# EAGLE design ATTINY85ZIF (EAGLE 6.5.0)
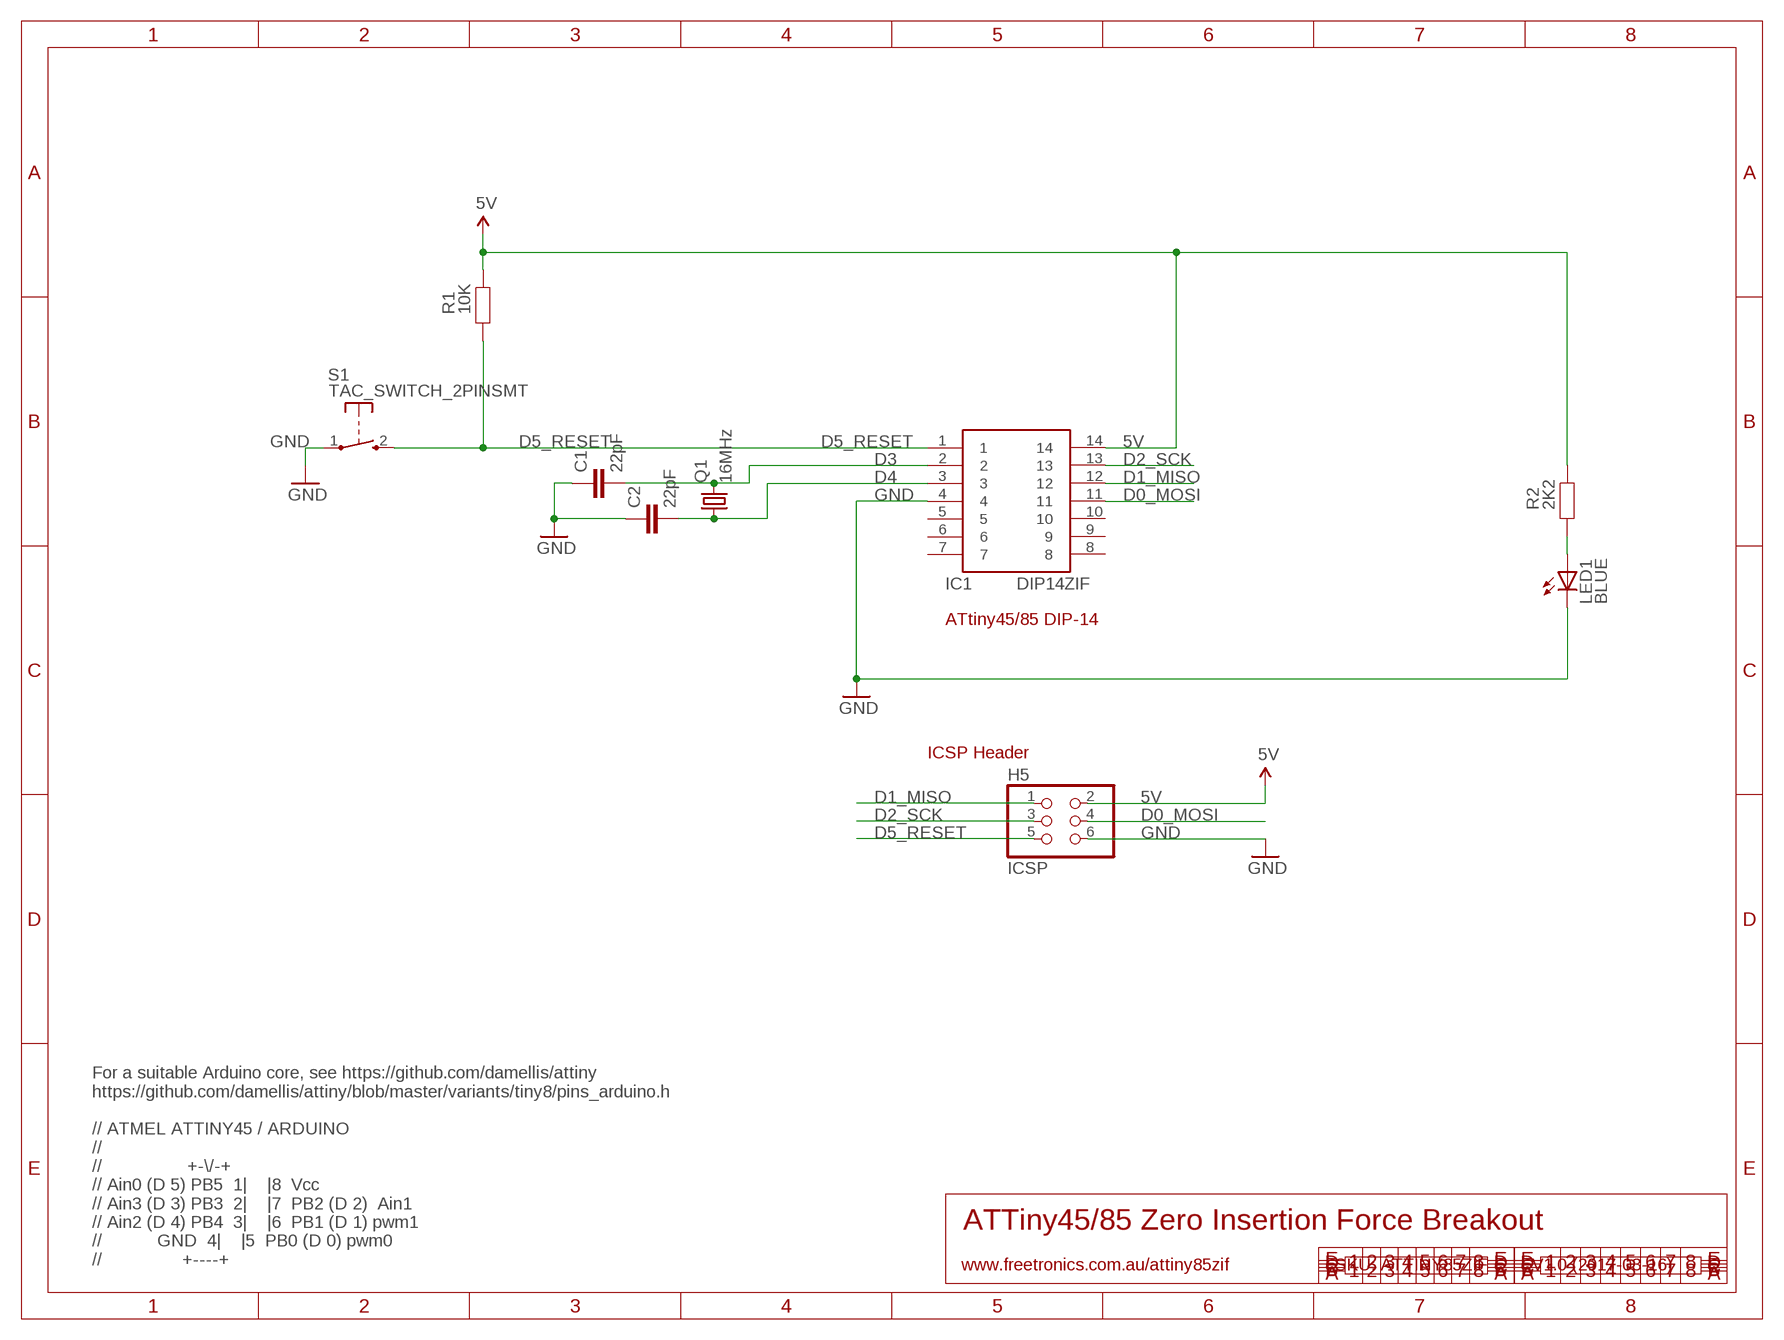
[diagram p0: schematic, sheet 1]

## Parts
C1  22pF  CAP0603  [0603]
C2  22pF  CAP0603  [0603]
H5  ICSP  PINHD-2X3  [2X03]
IC1  DIP14ZIF  [DIL14-3-ZIF]
LED1  BLUE  LED0603  [LED-0603]
Q1  16MHz  CRYSTALHC49US  [HC49US]
R1  10K  RESISTOR0603  [0603]
R2  2K2  RESISTOR0603  [0603]
S1  TAC_SWITCH_2PINSMT  [TACTILE_SWITCH_SMD_2PIN_TINY]

## Nets
5V: H5.2 IC1.14 R1.2 R2.2
D0_MOSI: H5.4 IC1.11
D1_MISO: H5.1 IC1.12
D2_SCK: H5.3 IC1.13
D3: C1.2 IC1.2 Q1.2
D4: C2.2 IC1.3 Q1.1
D5_RESET: H5.5 IC1.1 R1.1 S1.2(S)
GND: C1.1 C2.1 H5.6 IC1.4 LED1.C S1.1(P)
N$3: LED1.A R2.1
Unconnected: IC1.5 IC1.6 IC1.7 IC1.8 IC1.9 IC1.10

## Notes on the sheet
- ATtiny45/85 DIP-14
- ICSP Header
- ATTiny45/85 Zero Insertion Force Breakout
- For a suitable Arduino core, see https://github.com/damellis/attiny
  https://github.com/damellis/attiny/blob/master/variants/tiny8/pins_arduino.h
  
  // ATMEL ATTINY45 / ARDUINO
  //
  //                 +-\/-+
  // Ain0 (D 5) PB5  1|    |8  Vcc
  // Ain3 (D 3) PB3  2|    |7  PB2 (D 2)  Ain1
  // Ain2 (D 4) PB4  3|    |6  PB1 (D 1) pwm1
  //           GND  4|    |5  PB0 (D 0) pwm0
  //                +----+
- www.freetronics.com.au/attiny85zif | SKU: ATTINY85ZIF | V1.0 (2017-03-16)

## Library data of the parts
C1 C2 = freetronics-jon:CAP: Capacitor Standard 0603 ceramic capacitor, and 0.1" leaded capacitor.
H5 = pinhead:PINHD-2X3: PIN HEADER
IC1 = freetronics-jon:DIP14
LED1 = freetronics-jon:LED: LEDs Standard schematic elements and footprints for 5mm, 3mm, 1206, and 0603 sized LEDs. 5mm - Spark Fun Electronics SKU : COM-00529 (and others)
Q1 = freetronics-jon:CRYSTAL: Crystals Various standard crystals. Proven footprints. Spark Fun Electronics SKU : COM-00534
R1 R2 = freetronics-jon:RESISTOR: Resistor Basic schematic elements and footprints for 0603, 1206, and PTH 1/10th watt (small) resistors.
S1 = freetronics-jon:TAC_SWITCH_2PIN: Momentary Tactile Switch - 2 pin

## Board
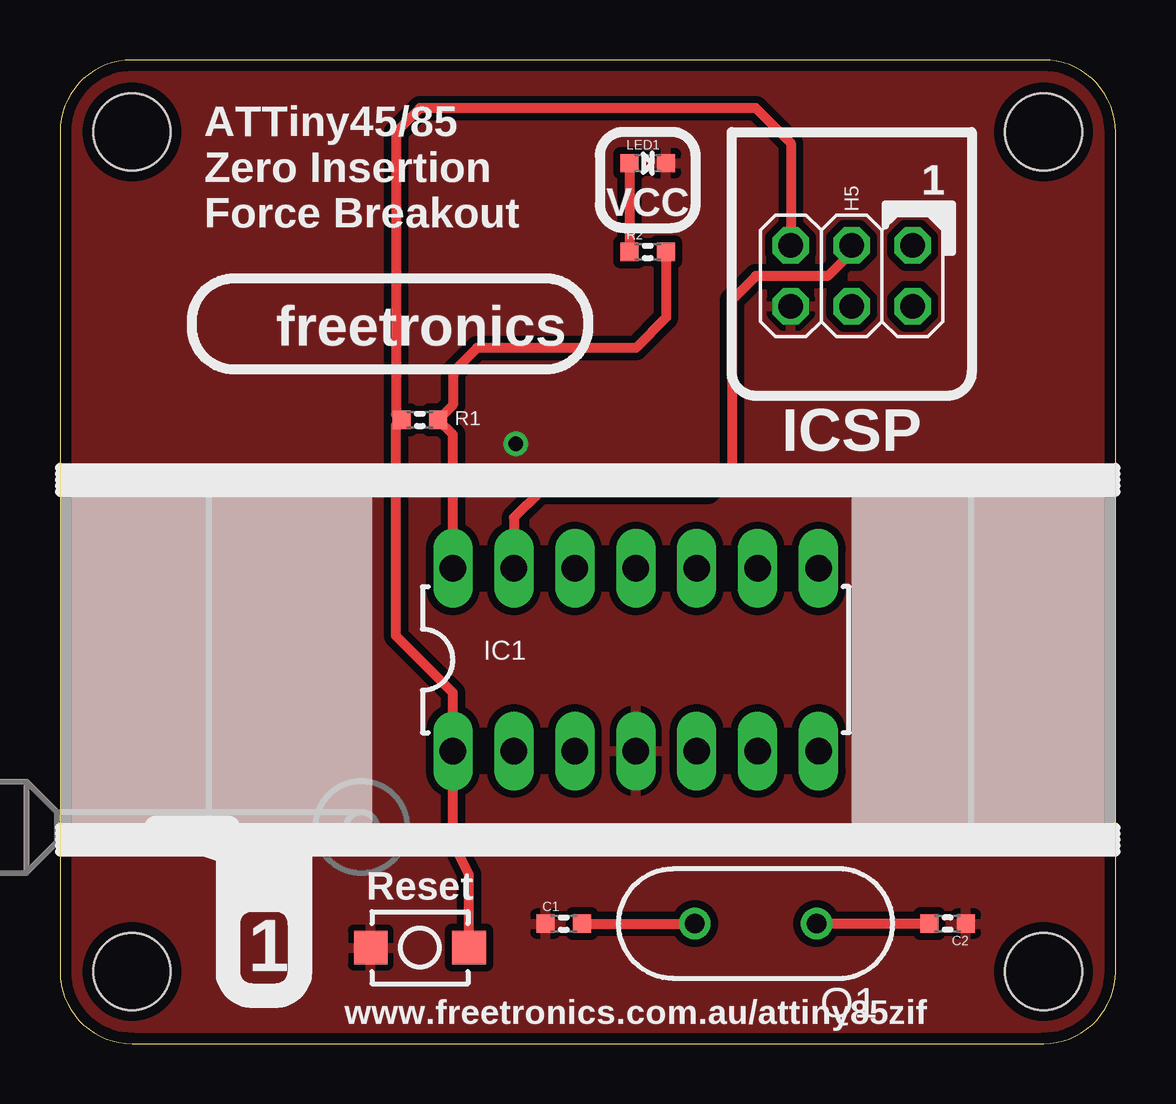
[diagram p1: board, top side]
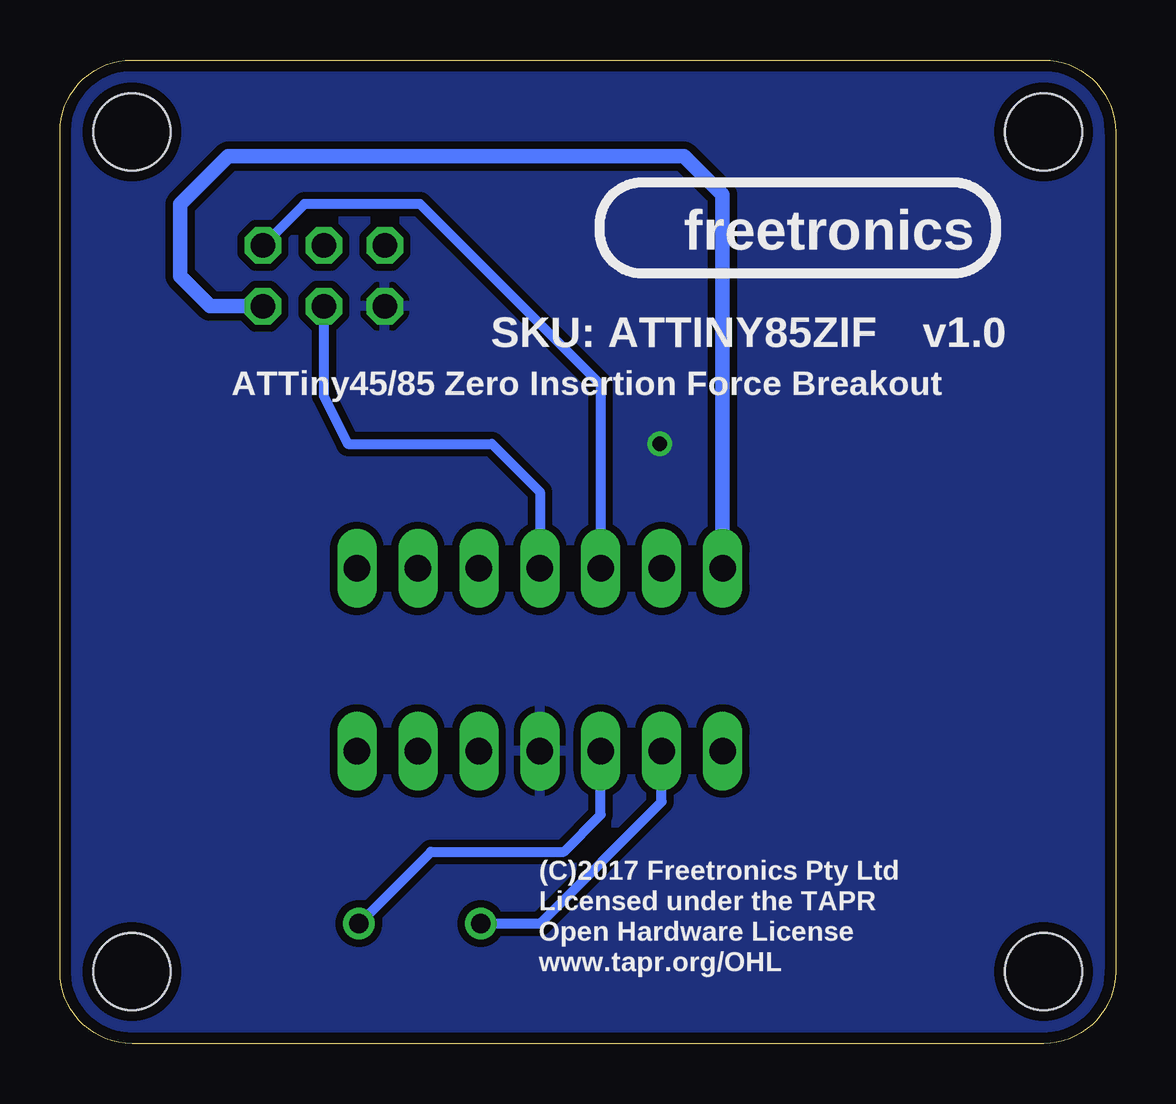
[diagram p2: board, bottom side, seen from below]

Size 44 x 41 mm. Coordinates in mm from the lower left corner, seen from the top.
Outline: 0,3 arc90 3,0 41,0 arc90 44,3 44,38 arc90 41,41 3,41 arc90 0,38 0,3
Copper layers (1*16): Top 0.035mm / dielectric 1.5mm / Bottom 0.035mm
Design rules "default *": minimum track width 10mil, minimum drill 18mil, track to track 10mil, track to pad 10mil, pad to pad 10mil, via to via 10mil, smd to smd 8mil, copper to edge 18mil, drill to drill 8mil, minimum pad ring 10mil, minimum via ring 8mil, stop-mask expansion 4mil, vias tented up to drill 25mil, thermal gap 10mil
Holes 3.2 mm at 41,38 41,3 3,38 3,3

### Footprints (pad centres in the part's own frame; a part is rotated, then mirrored left to right if it is on the bottom)
0603 = smd 0.762 x 0.762: 1 -0.762,0; 2 0.762,0
2X03 = drill 1.016 octagon: 1 -2.54,-1.27; 2 -2.54,1.27; 3 0,-1.27; 4 0,1.27; 5 2.54,-1.27; 6 2.54,1.27
DIL14-3-ZIF = drill 1.1 long: 1 -7.62,-3.81; 2 -5.08,-3.81; 3 -2.54,-3.81; 4 0,-3.81; 5 2.54,-3.81; 6 5.08,-3.81; 7 7.62,-3.81; 8 7.62,3.81; 9 5.08,3.81; 10 2.54,3.81; 11 0,3.81; 12 -2.54,3.81; 13 -5.08,3.81; 14 -7.62,3.81
LED-0603 = smd 0.762 x 0.762: A -0.762,0; C 0.762,0
HC49US = drill 0.813: 1 -2.54,0; 2 2.54,0
TACTILE_SWITCH_SMD_2PIN_TINY = smd 1.4 x 1.4: 1 -2.05,0; 2 2.05,0

### Placement (x,y rotation side)
C1  21,5 0 top
C2  37,5 180 top
H5  33,32 180 top
IC1  24,16 0 top
LED1  24.5,36.7 0 top
Q1  29,5 180 top
R1  15,26 0 top
R2  24.5,33 0 top
S1  15,4 0 top

### Tracks (layer width: path | path; a pad name or v marks a point on that pad's centre or on a via)
5V
  Top 0.406: IC1.14 16.38,25.38 R1.2 16.38,26.62 16.38,28 17.38,29 24,29 25.26,30.26 R2.2
  Bottom 0.61: H5.2 37.73,30.73 39,32 39,35 37,37 18,37 16.38,35.38 IC1.14
D0_MOSI
  Bottom 0.406: H5.4 33,27 32,25 26,25 24,23 IC1.11
D1_MISO
  Bottom 0.406: H5.1 33.81,35 29,35 21.46,27.46 IC1.12
D2_SCK
  Top 0.305: H5.3 33,33
  Top 0.406: 33,33 32,32 29,32 28,31 28,24 27,23 20,23 18.92,21.92 IC1.13
D3
  Top 0.406: C1.2 Q1.2
  Bottom 0.406: Q1.2 24,5 18.92,10.08 IC1.2
D4
  Top 0.406: C2.2 Q1.1
  Bottom 0.406: Q1.1 28.54,8 23,8 21.46,9.54 IC1.3
D5_RESET
  Top 0.406: S1.2 17.05,7.05 16.38,8.38 IC1.1 16.38,14.62 14,17 14,25.76 R1.1 14,26.24 14,38 15,39 29,39 30.46,37.54 H5.5
GND  (via drill 0.6)
  other vias: 19,25
  pour Bottom (isolate 0.305): 0,38 arc-90 3,41 41,41 arc-90 44,38 44,3 arc-90 41,0 3,0 arc-90 0,3
  pour Top (isolate 0.305): 0,38 arc-90 3,41 41,41 arc-90 44,38 44,3 arc-90 41,0 3,0 arc-90 0,3
N$3
  Top 0.406: LED1.A R2.1

### Text on the board
tPlace: 1 | ATTiny45/85 / Zero Insertion / Force Breakout | VCC | freetronics | ICSP | Reset | 1 | www.freetronics.com.au/attiny85zif
bPlace: freetronics | v1.0 | SKU: ATTINY85ZIF | ATTiny45/85 Zero Insertion Force Breakout | (C)2017 Freetronics Pty Ltd | Licensed under the TAPR | Open Hardware License | www.tapr.org/OHL